# Altium schematic sheet Schematic_DC_PowerSupply.SchDoc
size B; SheetNumber: 1; SheetTotal: 1
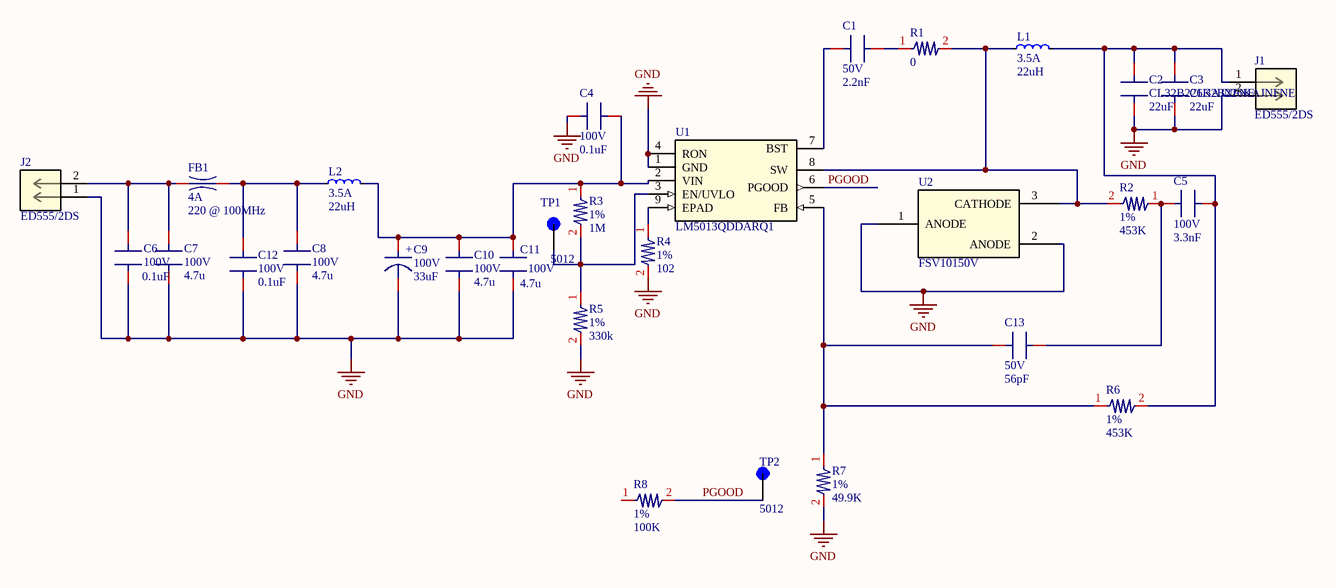
[diagram p0: Schematic_DC_PowerSupply.SchDoc]

## Parts
C1  value 2.2nF  RATING: 50V  [CAP_1608_TDK]  (hidden comment: CEU3E2X7R2A332K080AE)
C2  CL32B226KAJNFNE  value 22uF  [CAP_CL32_SAM]
C3  CL32B226KAJNFNE  value 22uF  [CAP_CL32_SAM]
C4  value 0.1uF  RATING: 100V  [HMK107_TAY]  (hidden comment: HMK107B7104KAHT)
C5  value 3.3nF  RATING: 100V  [CAP_1608_TDK]  (hidden comment: CEU3E2X7R2A332K080AE)
C6  value 0.1uF  RATING: 100V  [CAP_SMD_10P3X10P3_PAN]  (hidden comment: EEE-FK2A330P)
C7  value 4.7u  RATING: 100V  [CAP_3225_TDK]  (hidden comment: C3225X7S2A475K200AE)
C8  value 4.7u  RATING: 100V  [CAP_3225_TDK]  (hidden comment: C3225X7S2A475K200AE)
C9  value 33uF  RATING: 100V  [HMK107_TAY]  (hidden comment: HMK107B7104KAHT)
C10  value 4.7u  RATING: 100V  [CAP_3225_TDK]  (hidden comment: CGA6M3X7S2A475K200AB)
C11  value 4.7u  RATING: 100V  [HMK107_TAY]  (hidden comment: HMK107B7104KAHT)
C12  value 0.1uF  RATING: 100V  [CAP_0402C_AVX]  (hidden comment: 04025A560KAT2A)
C13  value 56pF  RATING: 50V  [RESC1005X04N]  (hidden comment: 66-000260)
FB1  value 220 @ 100MHz  RATING: 4A  [BEADC3216X180N]  (hidden comment: FBMH3216HM221NTV)
J1  ED555/2DS  [CONN_ED5552DS_OST]
J2  ED555/2DS  [CONN_ED5552DS_OST]
L1  value 22uH  RATING: 3.5A  [IND_1040-WE-LHMI_WRE]  (hidden comment: 74437368220)
L2  value 22uH  RATING: 3.5A  [IND_1040-WE-LHMI_WRE]  (hidden comment: 74437368220)
R1  value 0  [RESC1005X04N]  (hidden comment: 60-000402)
R2  value 453K  TOLERANCE: 1%  [RC0603N_YAG]  (hidden comment: RC0603FR-07453KL)
R3  value 1M  TOLERANCE: 1%  [RES_CRCW_0402]  (hidden comment: CRCW04021M00FKED)
R4  value 102  TOLERANCE: 1%  [RES_CRCW_0402]  (hidden comment: CRCW0402330KFKED)
R5  value 330k  TOLERANCE: 1%  [RC0603N_YAG]  (hidden comment: RC0603FR-07453KL)
R6  value 453K  TOLERANCE: 1%  [RES_CRCW_0402]  (hidden comment: CRCW040249K9FKED)
R7  value 49.9K  TOLERANCE: 1%  [RES_1005_SAM]  (hidden comment: RC1005F104CS)
R8  value 100K  TOLERANCE: 1%  [RESC1005X04N]  (hidden comment: 60-000508)
TP1  5012  [TP_5012]
TP2  5012  [TP_5012]
U1  LM5013QDDARQ1  [POWERPAD8_DDA_TEX]
U2  FSV10150V  [TO277-3L_ONS]

## Nets
GND: C2.1 C3.1 C4.1 C6.1 C7.1 C8.1 C9.1 C10.1 C11.1 C12.2 J1.2 J2.1 R4.2 R5.2 R7.2 U1.1(GND) U1.4(RON) U2.1(ANODE) U2.2(ANODE)
PGOOD: R8.2 TP2.TP U1.6(PGOOD)
NetC1_1: C1.1 U1.7(BST)
NetC1_2: C1.2 R1.1
NetC2_2: C2.2 C3.2 C5.2 J1.1 L1.1 R6.2
NetC4_2: C4.2 C9.1 C10.1 C11.1 L2.1 R3.1 U1.2(VIN)
NetC5_1: C5.1 C13.2 R2.1
NetC6_1: C6.1 C7.1 FB1.1 J2.2
NetC8_1: C8.1 C12.1 FB1.2 L2.2
NetC13_1: C13.1 R6.1 R7.1 U1.5(FB)
NetL1_2: L1.2 R1.2 R2.2 U1.8(SW) U2.3(CATHODE)
NetR3_2: R3.2 R5.1 TP1.TP U1.3(EN/UVLO)
NetR4_1: R4.1 U1.9(EPAD)

Not connected (* = marked no-connect by the designer): R8 1

## Notes on the sheet
- (in symbol CAP-100127-33uF-20%-100V) +

## Library data of the parts
C1 = CAP-1005-2.7nF-10%-50V: CAP CER 2.2nF 50V X7R 1005; PART NUMBER: 66-000203; PRI MFR NUMBER: Murata, GRM155R71H272KA01D; ALT1 MFR NUMBER: Kemet, C1210C225K5RACTU; ALT2 MFR NUMBER: Vishay Vitramon, VJ0402Y272KNAAJ; TOLERANCE: 10%; EE VERIFIED: YES
C2 C3 = CAP-3225-22uFF-20%-25V: CAP CER 22uF 20% 25V X5R 3235 (1210); ALT1 MFR NUMBER: Kyocera, CM32X5R226M25AT; ALT2 MFR NUMBER: Venkel, C1210X7R250-226KNE-CT; PART NUMBER: 66-000233; PRI MFR NUMBER: KEMET,C1210C226M3PACTU; EE VERIFIED: NO; CREATED BY: VG; CREATED DATE: Aug 20 2021; RATING: 25V; TOLERANCE: 20%
C4 C6 C12 = CAP-1608-0.1uF-10%-100V: Ceramic,0.1uF, 100V,10%,X7S, 1608,SMD; PART NUMBER: 66-000086; PRI MFR NUMBER: TDK,C1608X7S2A104K; EE VERIFIED: YES; ID: 24150; CREATED BY: Wayne; CREATED DATE: 7/28/2011 5:01:26 PM; TOLERANCE: 10%
C5 = CAP-1608-3300pF-10%-100V: CAP CER 3300PF (3n3) 100V 10% X7R 1608; PART NUMBER: 66-000160; PRI MFR NUMBER: Murata, GRM188R72A332KA01D; EE VERIFIED: YES; ID: 27959; CREATED BY: Wayne; CREATED DATE: 2017-05-02 10:34:43 AM; TOLERANCE: 10%
C7 C8 C10 C11 = CAP-3225-4.7uF-10%-100V: CAP 3225 X7R 100V 4.7UF 10% 2.50; ALT1 MFR NUMBER: 12101C475KAT2A; ALT2 MFR NUMBER: CL32B475KCIZNWE; PART NUMBER: 66-000252; PRI MFR NUMBER: CNC6P1X7R2A475K250AE; EE VERIFIED: YES; CREATED BY: Akshat Doctor; CREATED DATE: 09/08/2022; TOLERANCE: 10%
C9 = CAP-100127-33uF-20%-100V: CAP POLY 33UF 40mOhm 100V 20% SMD; ALT1 MFR NUMBER: Wurth, 875575961005; PART NUMBER: 660-000305; PRI MFR NUMBER: Wurth, 875585961005; EE VERIFIED: NO; ID: 0; CREATED BY: VG; CREATED DATE: 2023-09-05; TOLERANCE: 20%
C13 = CAP-1005-47pF-5%-50V: CAP CER 56pF 50V C0G 1005; PRI MFR NUMBER: Samsung, CL05C470JB5NNNC; ALT1 MFR NUMBER: Walsin, 0402N470J500CT; ALT2 MFR NUMBER: Murata, CAP CER 47PF 50V C0G/NP0 0402; TOLERANCE: 5%; EE VERIFIED: YES; PART NUMBER: 66-000260; CREATED BY: Vlad Geyts; CREATED DATE: 11/17/2022
FB1 = FB-1206-220-4A-FBMH3216HM221NTV: FERRITE CHIP 220 OHM 4A 1206; PART NUMBER: 58-000026; PRI MFR NUMBER: TDK, MMZ2012Y202B or Equiv; EE VERIFIED: YES; ID: 24749; TOLERANCE: NA; CREATED BY: Wayne; CREATED DATE: 4/16/2012 5:35:12 PM
J1 J2 = ED5552DS_1: Terminal Block, 3.5mm, 2x1; Mfr_Name: On Shore Technology; Copyright: Copyright (C) 2023 Ultra Librarian. All rights reserved.; Manufacturer_Part_Number: ED555/2DS; Digi-Key_Part_Number_1: ED1514-ND; Digi-Key_Part_Number_2: ED1514-NDL; RefDes: RefDes; Type: DEV
L1 L2 = IND-7373-270uH-20%-0.43A: SHIELDED FIXED IND 22uH 3.5A 74mohm SM; ALT1 MFR NUMBER: 7447779270; PART NUMBER: 58-000127; PRI MFR NUMBER: 744777270; EE VERIFIED: NO; TOLERANCE: 20%; CREATED BY: Akshat Doctor; CREATED DATE: 09/06/2022
R1 = RES-1005-49.9K-1%-55V-1/16W: 0, 1%, 1005, SMD; PRI MFR NUMBER: Vishay Dale, CRCW040249K9FKED; ALT1 MFR NUMBER: Bourns, CR0402-FX-4992GLF; ALT2 MFR NUMBER: YAGEO, RC0402FR-0749K9L; RATING: 1/16W; EE VERIFIED: NO; PART NUMBER: 60-000402; CREATED BY: VG; CREATED DATE: Aug 10 2021; TOLERANCE: 1%
R2 = RES-1608-475K-1%-200V-1/10W: 475K, 1%, 1608, SMD; ALT1 MFR NUMBER: Panasonic, ERJ-3EKF4753; ALT2 MFR NUMBER: Rohm, MCR03EZPFX4753; PART NUMBER: 60-000071; PRI MFR NUMBER: Venkel, CR0603-10W-4753FT; EE VERIFIED: YES; ID: 7081; RATING: 1/10W; CREATED BY: Wayne
R3 = RES-1005-1M-1%-50V-1/16W: 1M, 1%, 1005, SMD; PART NUMBER: 60-000346; PRI MFR NUMBER: Vishay, CRCW04021M00FKED; ALT1 MFR NUMBER: Panasonic, ERJ-2RKF1004X; ALT2 MFR NUMBER: Samsung, RC1005F105CS; RATING: 1/16W; EE VERIFIED: YES; CREATED BY: VG
R4 = RES-1005-1M-1%-50V-1/16W: 102 ohm, 1%, 1005, SMD; PART NUMBER: 60-000346; PRI MFR NUMBER: Vishay, CRCW04021M00FKED; ALT1 MFR NUMBER: Panasonic, ERJ-2RKF1004X; ALT2 MFR NUMBER: Samsung, RC1005F105CS; RATING: 1/16W; EE VERIFIED: YES; CREATED BY: VG
R5 = RES-1005-1M-1%-50V-1/16W: 330k, 1%, 1005, SMD; PART NUMBER: 60-000346; PRI MFR NUMBER: Vishay, CRCW04021M00FKED; ALT1 MFR NUMBER: Panasonic, ERJ-2RKF1004X; ALT2 MFR NUMBER: Samsung, RC1005F105CS; RATING: 1/16W; EE VERIFIED: YES; CREATED BY: VG
R6 = RES-1608-475K-1%-200V-1/10W: 453K, 1%, 1608, SMD; ALT1 MFR NUMBER: Panasonic, ERJ-3EKF4753; ALT2 MFR NUMBER: Rohm, MCR03EZPFX4753; PART NUMBER: 60-000071; PRI MFR NUMBER: Venkel, CR0603-10W-4753FT; EE VERIFIED: YES; ID: 7081; RATING: 1/10W; CREATED BY: Wayne
R7 = RES-1005-475K-1%-50V-1/16W: 49.9K, 1%, 1005, SMD; PART NUMBER: 60-000508; PRI MFR NUMBER: YAGEO, RC0402FR-07475KL; ALT1 MFR NUMBER: Stackpole, RMCF0402FT475K; ALT2 MFR NUMBER: Bourns, CR0402-FX-4753GLF; RATING: 1/16W; EE VERIFIED: YES; CREATED BY: Vlad  Geyts; CREATED DATE: 10/25/2022
R8 = RES-1005-475K-1%-50V-1/16W: 100K, 1%, 1005, SMD; PRI MFR NUMBER: YAGEO, RC0402FR-07475KL; ALT1 MFR NUMBER: Stackpole, RMCF0402FT475K; ALT2 MFR NUMBER: Bourns, CR0402-FX-4753GLF; RATING: 1/16W; EE VERIFIED: YES; PART NUMBER: 60-000508; CREATED BY: Vlad  Geyts; CREATED DATE: 10/25/2022
U1 = LM5013QDDARQ1: U_LM5013_100V_Buck_Converter; Mfr_Name: Texas Instruments; Copyright: Copyright (C) 2023 Ultra Librarian. All rights reserved.; Manufacturer_Part_Number: LM5013QDDARQ1; RefDes: RefDes; Type: DEV
U2 = FSV10150V_1: Schottkey Diode, 150V, 10A, 3-Pin; Mfr_Name: onsemi; Copyright: Copyright (C) 2023 Ultra Librarian. All rights reserved.; Manufacturer_Part_Number: FSV10150V; Digi-Key_Part_Number_1: 2156-FSV10150V-ND; Digi-Key_Part_Number_2: 2156-FSV10150V-OS-ND; Digi-Key_Part_Number_3: FSV10150VCT-ND; Digi-Key_Part_Number_4: FSV10150VDKR-ND; Digi-Key_Part_Number_5: FSV10150VTR-ND; RefDes: RefDes; Type: DEV
TP1 TP2 = 5012: Availability: Unavailable; Value: *; Price: None; MP: 5012; Package: None